# Altium schematic sheet PAGE1-CONTENT.SchDoc
size A3; DocumentNumber: 1; SheetNumber: 1; SheetTotal: 5
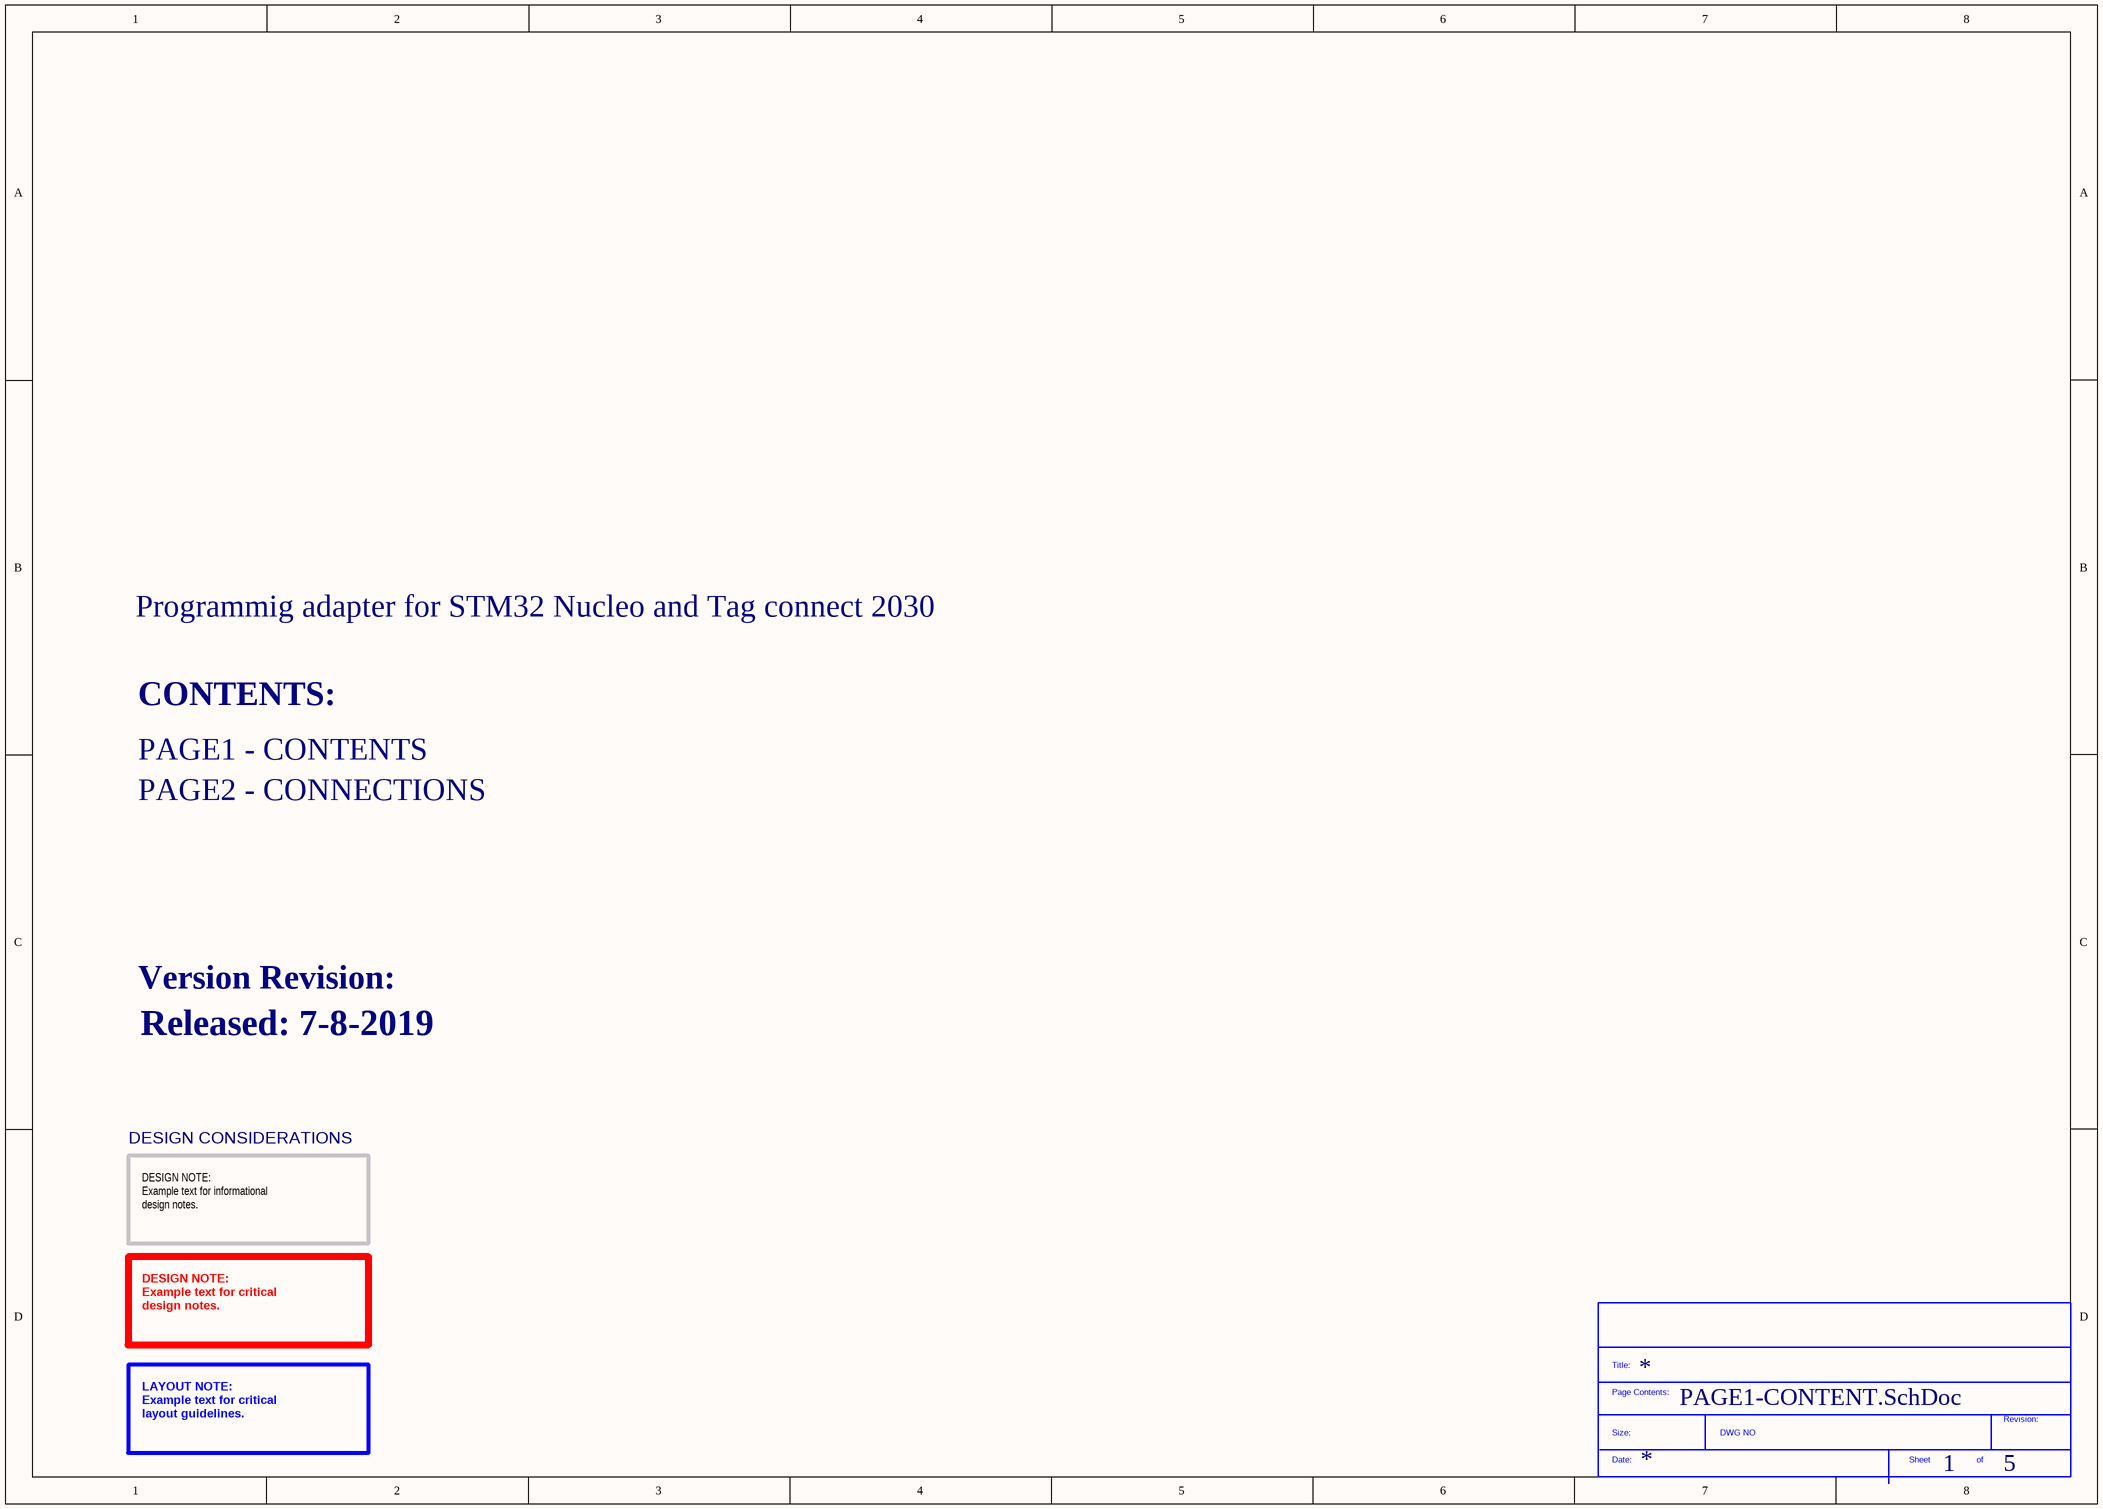
[diagram p0: PAGE1-CONTENT.SchDoc]

## Parts
*?  SDTitleBlock  (value not drawn)  (graphical)

## Notes on the sheet
- Programmig adapter for STM32 Nucleo and Tag connect 2030
- CONTENTS:
- PAGE1 - CONTENTS
- PAGE2 - CONNECTIONS
- Version Revision:
- Released: 7-8-2019
- DESIGN CONSIDERATIONS
- DESIGN NOTE:
  Example text for informational
  design notes.
- DESIGN NOTE:
  Example text for critical
  design notes.
- LAYOUT NOTE:
  Example text for critical
  layout guidelines.
- (in symbol SDTitleBlock) Title:; Page Contents:; Revision:; Size:; DWG NO; Date:; Sheet; of